# EAGLE schematic 081_fotocellule (EAGLE 7.2.0)
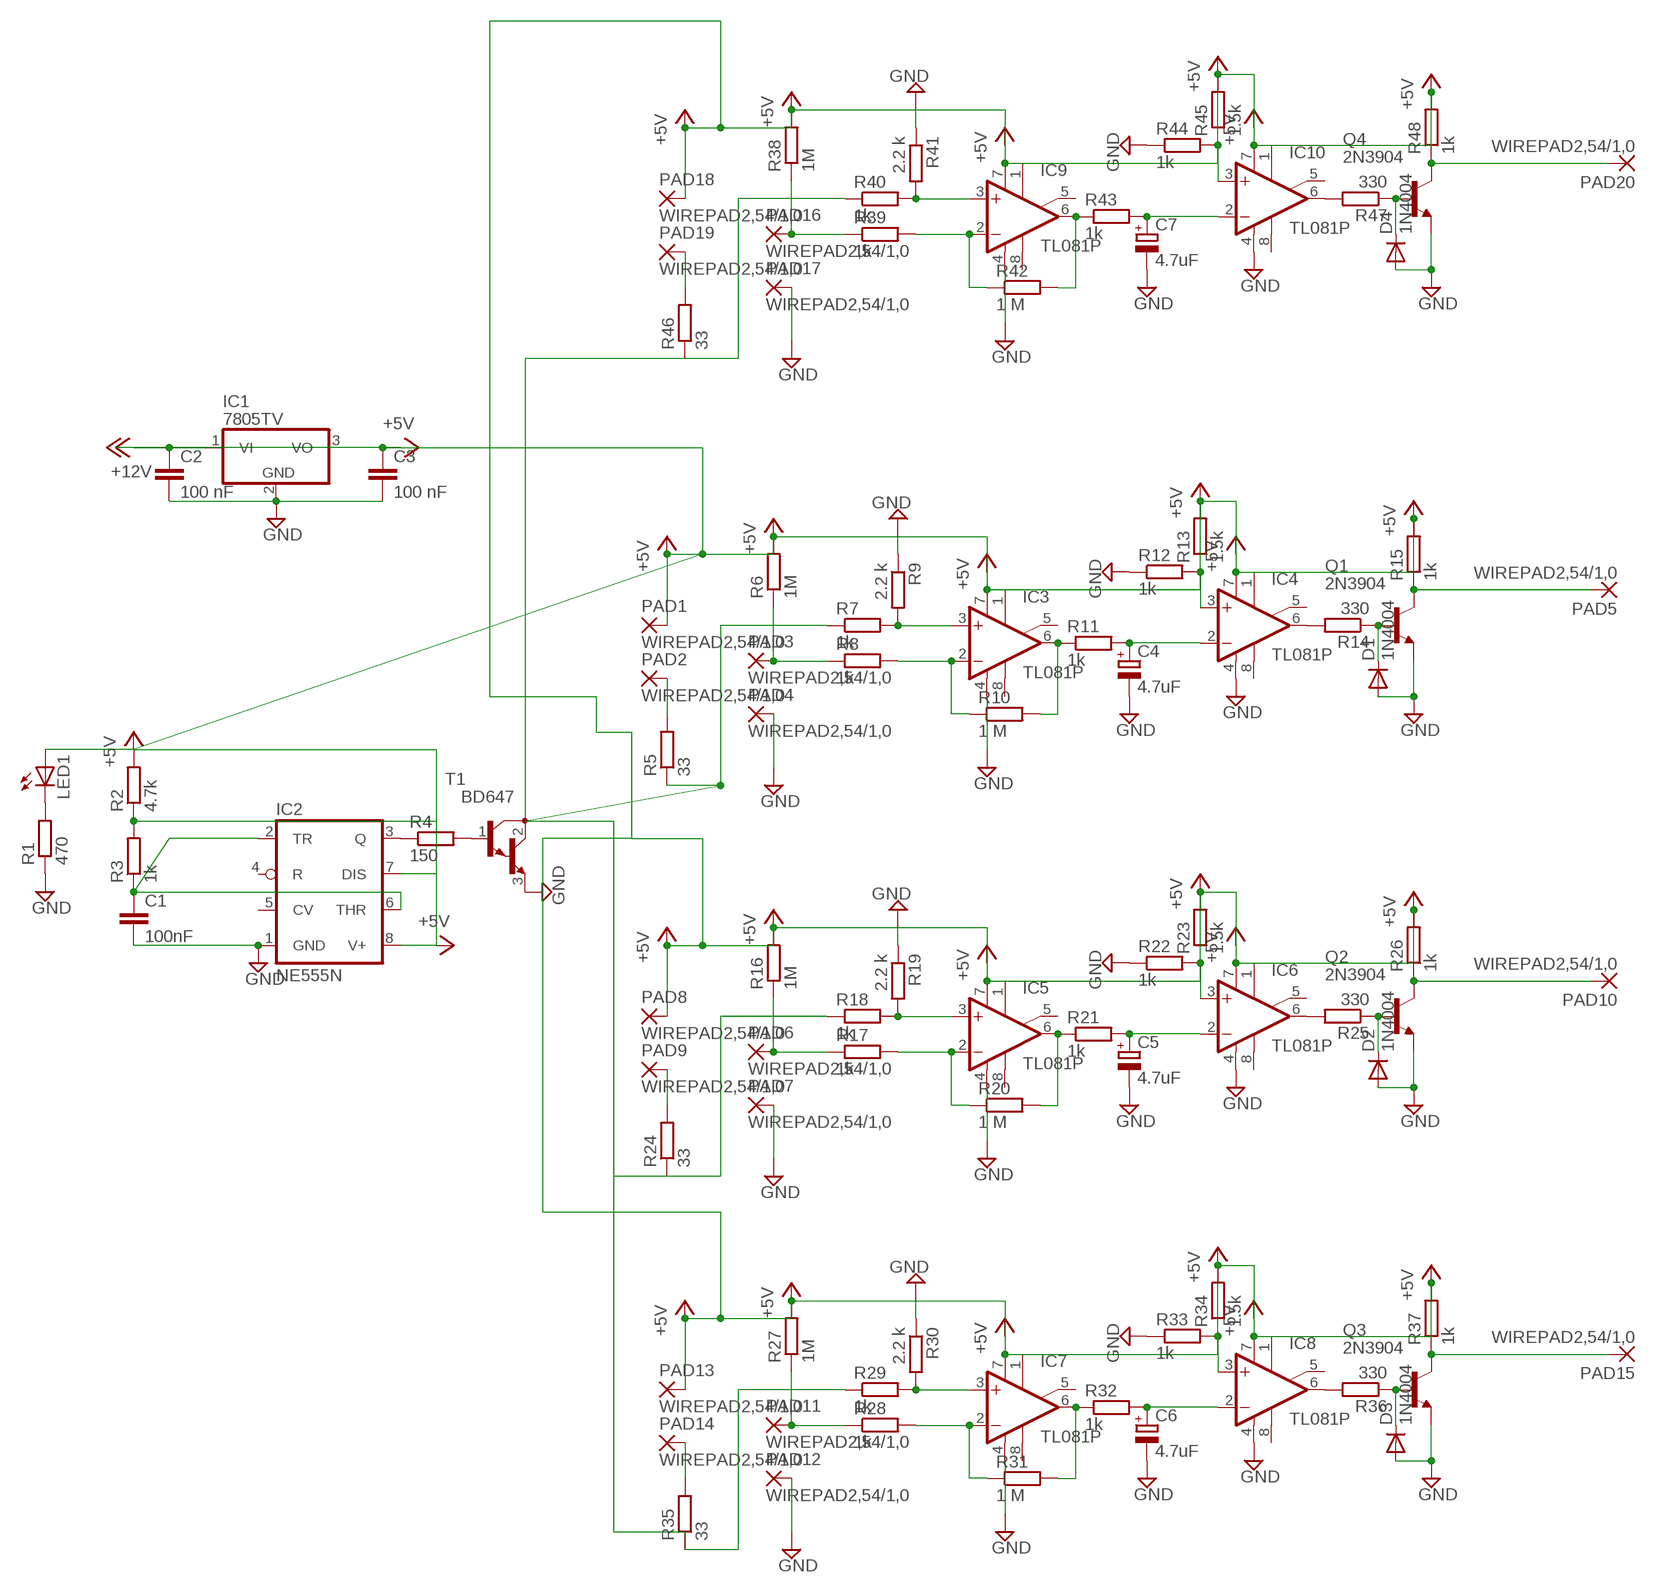
[diagram p0: schematic, sheet 1]

## Parts
C1  100nF  C-EU025-024X044  [C025-024X044]
C2  100 nF  C-EU025-024X044  [C025-024X044]
C3  100 nF  C-EU025-024X044  [C025-024X044]
C4  4.7uF  CPOL-EUE2.5-6  [E2,5-6]
C5  4.7uF  CPOL-EUE2.5-6  [E2,5-6]
C6  4.7uF  CPOL-EUE2.5-6  [E2,5-6]
C7  4.7uF  CPOL-EUE2.5-6  [E2,5-6]
D1  1N4004  [DO41-10]
D2  1N4004  [DO41-10]
D3  1N4004  [DO41-10]
D4  1N4004  [DO41-10]
IC1  7805TV  [TO220V]
IC2  NE555N  [DIL08]
IC3  TL081P  [DIL08]
IC4  TL081P  [DIL08]
IC5  TL081P  [DIL08]
IC6  TL081P  [DIL08]
IC7  TL081P  [DIL08]
IC8  TL081P  [DIL08]
IC9  TL081P  [DIL08]
IC10  TL081P  [DIL08]
LED1  LED5MM  [LED5MM]
PAD1  WIREPAD2,54/1,0  [2,54/1,0]
PAD2  WIREPAD2,54/1,0  [2,54/1,0]
PAD3  WIREPAD2,54/1,0  [2,54/1,0]
PAD4  WIREPAD2,54/1,0  [2,54/1,0]
PAD5  WIREPAD2,54/1,0  [2,54/1,0]
PAD6  WIREPAD2,54/1,0  [2,54/1,0]
PAD7  WIREPAD2,54/1,0  [2,54/1,0]
PAD8  WIREPAD2,54/1,0  [2,54/1,0]
PAD9  WIREPAD2,54/1,0  [2,54/1,0]
PAD10  WIREPAD2,54/1,0  [2,54/1,0]
PAD11  WIREPAD2,54/1,0  [2,54/1,0]
PAD12  WIREPAD2,54/1,0  [2,54/1,0]
PAD13  WIREPAD2,54/1,0  [2,54/1,0]
PAD14  WIREPAD2,54/1,0  [2,54/1,0]
PAD15  WIREPAD2,54/1,0  [2,54/1,0]
PAD16  WIREPAD2,54/1,0  [2,54/1,0]
PAD17  WIREPAD2,54/1,0  [2,54/1,0]
PAD18  WIREPAD2,54/1,0  [2,54/1,0]
PAD19  WIREPAD2,54/1,0  [2,54/1,0]
PAD20  WIREPAD2,54/1,0  [2,54/1,0]
Q1  2N3904  [TO92]
Q2  2N3904  [TO92]
Q3  2N3904  [TO92]
Q4  2N3904  [TO92]
R1  470  R-EU_0207/10  [0207/10]
R2  4.7k  R-EU_0207/10  [0207/10]
R3  1k  R-EU_0207/10  [0207/10]
R4  150  R-EU_0207/10  [0207/10]
R5  33  R-EU_0207/10  [0207/10]
R6  1M  R-EU_0207/10  [0207/10]
R7  1k  R-EU_0207/10  [0207/10]
R8  1k  R-EU_0207/10  [0207/10]
R9  2.2 k  R-EU_0207/10  [0207/10]
R10  1 M  R-EU_0207/10  [0207/10]
R11  1k  R-EU_0207/10  [0207/10]
R12  1k  R-EU_0207/10  [0207/10]
R13  1.5k  R-EU_0207/10  [0207/10]
R14  330  R-EU_0207/10  [0207/10]
R15  1k  R-EU_0207/10  [0207/10]
R16  1M  R-EU_0207/10  [0207/10]
R17  1k  R-EU_0207/10  [0207/10]
R18  1k  R-EU_0207/10  [0207/10]
R19  2.2 k  R-EU_0207/10  [0207/10]
R20  1 M  R-EU_0207/10  [0207/10]
R21  1k  R-EU_0207/10  [0207/10]
R22  1k  R-EU_0207/10  [0207/10]
R23  1.5k  R-EU_0207/10  [0207/10]
R24  33  R-EU_0207/10  [0207/10]
R25  330  R-EU_0207/10  [0207/10]
R26  1k  R-EU_0207/10  [0207/10]
R27  1M  R-EU_0207/10  [0207/10]
R28  1k  R-EU_0207/10  [0207/10]
R29  1k  R-EU_0207/10  [0207/10]
R30  2.2 k  R-EU_0207/10  [0207/10]
R31  1 M  R-EU_0207/10  [0207/10]
R32  1k  R-EU_0207/10  [0207/10]
R33  1k  R-EU_0207/10  [0207/10]
R34  1.5k  R-EU_0207/10  [0207/10]
R35  33  R-EU_0207/10  [0207/10]
R36  330  R-EU_0207/10  [0207/10]
R37  1k  R-EU_0207/10  [0207/10]
R38  1M  R-EU_0207/10  [0207/10]
R39  1k  R-EU_0207/10  [0207/10]
R40  1k  R-EU_0207/10  [0207/10]
R41  2.2 k  R-EU_0207/10  [0207/10]
R42  1 M  R-EU_0207/10  [0207/10]
R43  1k  R-EU_0207/10  [0207/10]
R44  1k  R-EU_0207/10  [0207/10]
R45  1.5k  R-EU_0207/10  [0207/10]
R46  33  R-EU_0207/10  [0207/10]
R47  330  R-EU_0207/10  [0207/10]
R48  1k  R-EU_0207/10  [0207/10]
T1  BD647  [TO220]

## Nets
+5V: C3.1 IC1.3(VO) IC2.8(V+) IC3.7(V+) IC4.7(V+) IC5.7(V+) IC6.7(V+) IC7.7(V+) IC8.7(V+) IC9.7(V+) IC10.7(V+) LED1.A PAD1.1(P) PAD8.1(P) PAD13.1(P) PAD18.1(P) R2.2 R6.2 R13.2 R15.2 R16.2 R23.2 R26.2 R27.2 R34.2 R37.2 R38.2 R45.2 R48.2
GND: C1.2 C2.2 C3.2 C4.- C5.- C6.- C7.- D1.A D2.A D3.A D4.A IC1.2(GND) IC2.1(GND) IC3.4(V-) IC4.4(V-) IC5.4(V-) IC6.4(V-) IC7.4(V-) IC8.4(V-) IC9.4(V-) IC10.4(V-) PAD4.1(P) PAD7.1(P) PAD12.1(P) PAD17.1(P) Q1.3(E) Q2.3(E) Q3.3(E) Q4.3(E) R1.1 R9.1 R12.1 R19.1 R22.1 R30.1 R33.1 R41.1 R44.1 T1.3(E)
N$1: PAD3.1(P) R6.1 R8.1
N$2: IC3.2(-IN) R8.2 R10.1
N$3: IC3.3(+IN) R7.2 R9.2
N$4: IC3.6(OUT) R10.2 R11.1
N$5: C4.+ IC4.2(-IN) R11.2
N$6: IC4.3(+IN) R12.2 R13.1
N$7: PAD2.1(P) R5.2
N$8: PAD6.1(P) R16.1 R17.1
N$9: IC2.3(Q) R4.1
N$10: C1.1 IC2.2(TR) IC2.6(THR) R3.1
N$11: IC4.6(OUT) R14.2
N$12: R4.2 T1.1(B)
N$13: IC5.2(-IN) R17.2 R20.1
N$14: LED1.K(C) R1.2
N$15: IC2.7(DIS) R2.1 R3.2
N$16: PAD5.1(P) Q1.1(C) R15.1
N$17: IC5.3(+IN) R18.2 R19.2
N$18: D1.C Q1.2(B) R14.1
N$19: IC5.6(OUT) R20.2 R21.1
N$20: C5.+ IC6.2(-IN) R21.2
N$21: IC6.3(+IN) R22.2 R23.1
N$23: PAD9.1(P) R24.2
N$25: PAD10.1(P) Q2.1(C) R26.1
N$26: D2.C Q2.2(B) R25.1
N$27: IC6.6(OUT) R25.2
N$28: PAD11.1(P) R27.1 R28.1
N$29: IC7.2(-IN) R28.2 R31.1
N$30: IC7.3(+IN) R29.2 R30.2
N$31: IC7.6(OUT) R31.2 R32.1
N$32: C6.+ IC8.2(-IN) R32.2
N$33: IC8.3(+IN) R33.2 R34.1
N$34: PAD14.1(P) R35.2
N$36: PAD15.1(P) Q3.1(C) R37.1
N$37: D3.C Q3.2(B) R36.1
N$38: IC8.6(OUT) R36.2
N$39: PAD16.1(P) R38.1 R39.1
N$40: IC9.2(-IN) R39.2 R42.1
N$41: IC9.3(+IN) R40.2 R41.2
N$42: IC9.6(OUT) R42.2 R43.1
N$43: C7.+ IC10.2(-IN) R43.2
N$44: IC10.3(+IN) R44.2 R45.1
N$45: PAD19.1(P) R46.2
N$46: R5.1 R7.1 R18.1 R24.1 R29.1 R35.1 R40.1 R46.1 T1.2(C)
N$47: PAD20.1(P) Q4.1(C) R48.1
N$48: D4.C Q4.2(B) R47.1
N$49: IC10.6(OUT) R47.2
VCC: C2.1 IC1.1(VI) ; supply symbol labelled +12V
Unconnected: IC2.4(R) IC2.5(CV) IC3.1(ON1) IC3.5(ON2) IC3.8(OPT) IC4.1(ON1) IC4.5(ON2) IC4.8(OPT) IC5.1(ON1) IC5.5(ON2) IC5.8(OPT) IC6.1(ON1) IC6.5(ON2) IC6.8(OPT) IC7.1(ON1) IC7.5(ON2) IC7.8(OPT) IC8.1(ON1) IC8.5(ON2) IC8.8(OPT) IC9.1(ON1) IC9.5(ON2) IC9.8(OPT) IC10.1(ON1) IC10.5(ON2) IC10.8(OPT)

## Library data of the parts
C1-C3 = resistor:C-EU: CAPACITOR, European symbol
C4-C7 = resistor:CPOL-EU: POLARIZED CAPACITOR, European symbol
D1-D4 = diode:1N4004: DIODE general purpose rectifier, 1 A
IC1 = linear:78*: Positive VOLTAGE REGULATOR Source: http://cache.national.com/ds/LM/LM78L05.pdf http://www.fairchildsemi.com/ds/LM/LM7805.pdf
IC2 = linear:*555: TIMER
IC3-IC10 = linear:TL081: OP AMP
LED1 = led:LED: LED OSRAM: - CHIPLED LG R971, LG N971, LY N971, LG Q971, LY Q971, LO R971, LY R971 LH N974, LH R974 LS Q976, LO Q976, LY Q976 LO Q996 - Hyper CHIPLED LW Q18S LB Q993, LB Q99A, LB R99A - SideLED LS A670, LO A670, LY A670, LG A670, LP A670 LB A673, LV A673, LT A673, LW A673 LH A674 LY A675 LS A676, LA A676, LO A676, LY A676, LW A676 LS A679, LY A679, LG A679 - Hyper Micro SIDELED® LS Y876, LA Y876, LO Y876, LY Y876 LT Y87S - SmartLED LW L88C, LW L88S LB L89C, LB L89S, LG L890 LS L89K, LO L89K, LY L89K LS L896, LA L896, LO L896, LY L896 - TOPLED LS T670, LO T670, LY T670, LG T670, LP T670 LSG T670, LSP T670, LSY T670, LOP T670, LYG T670 LG T671, LOG T671, LSG T671 LB T673, LV T673, LT T673, LW T673 LH T674 LS T676, LA T676, LO T676, LY T676, LB T676, LH T676, LSB T676, LW T676 LB T67C, LV T67C, LT T67C, LS T67K, LO T67K, LY T67K, LW E67C LS E67B, LA E67B, LO E67B, LY E67B, LB E67C, LV E67C, LT E67C LW T67C LS T679, LY T679, LG T679 LS T770, LO T770, LY T770, LG T770, LP T770 LB T773, LV T773, LT T773, LW T773 LH T774 LS E675, LA E675, LY E675, LS T675 LS T776, LA T776, LO T776, LY T776, LB T776 LHGB T686 LT T68C, LB T68C - Hyper Mini TOPLED® LB M676 - Mini TOPLED Santana® LG M470 LS M47K, LO M47K, LY M47K Source: http://www.osram.convergy.de LUXEON: - LUMILED® LXK2-PW12-R00, LXK2-PW12-S00, LXK2-PW14-U00, LXK2-PW14-V00 LXK2-PM12-R00, LXK2-PM12-S00, LXK2-PM14-U00 LXK2-PE12-Q00, LXK2-PE12-R00, LXK2-PE12-S00, LXK2-PE14-T00, LXK2-PE14-U00 LXK2-PB12-K00, LXK2-PB12-L00, LXK2-PB12-M00, LXK2-PB14-N00, LXK2-PB14-P00, LXK2-PB14-Q00 LXK2-PR12-L00, LXK2-PR12-M00, LXK2-PR14-Q00, LXK2-PR14-R00 LXK2-PD12-Q00, LXK2-PD12-R00, LXK2-PD12-S00 LXK2-PH12-R00, LXK2-PH12-S00 LXK2-PL12-P00, LXK2-PL12-Q00, LXK2-PL12-R00 Source: www.luxeon.com KINGBRIGHT: KA-3528ASYC Source: www.kingbright.com
PAD1-PAD20 = wirepad:WIREPAD: Wire PAD connect wire on PCB
Q1-Q4 = transistor-npn:2N3904: NPN Transistor
R1-R48 = resistor:R-EU_: RESISTOR, European symbol
T1 = transistor:BD647: NPN BIPOLAR DARLINGTON TRANSISTOR